# Altium schematic sheet Others.SchDoc: Others
size A4; ApprovedBy: Eli; CheckedBy: Eli; DrawnBy: Eli; Engineer: Eli; Organization: 富源盛电子科技有限公司; Address1: 深圳市龙华新区; Address2: 观澜街道科利邦工业园; Address3: B栋（宿舍楼）15楼; Address4: T: 159 8944 7740; DocumentNumber: 3; Revision: 1.0; SheetNumber: 3; SheetTotal: 8; Status: Final
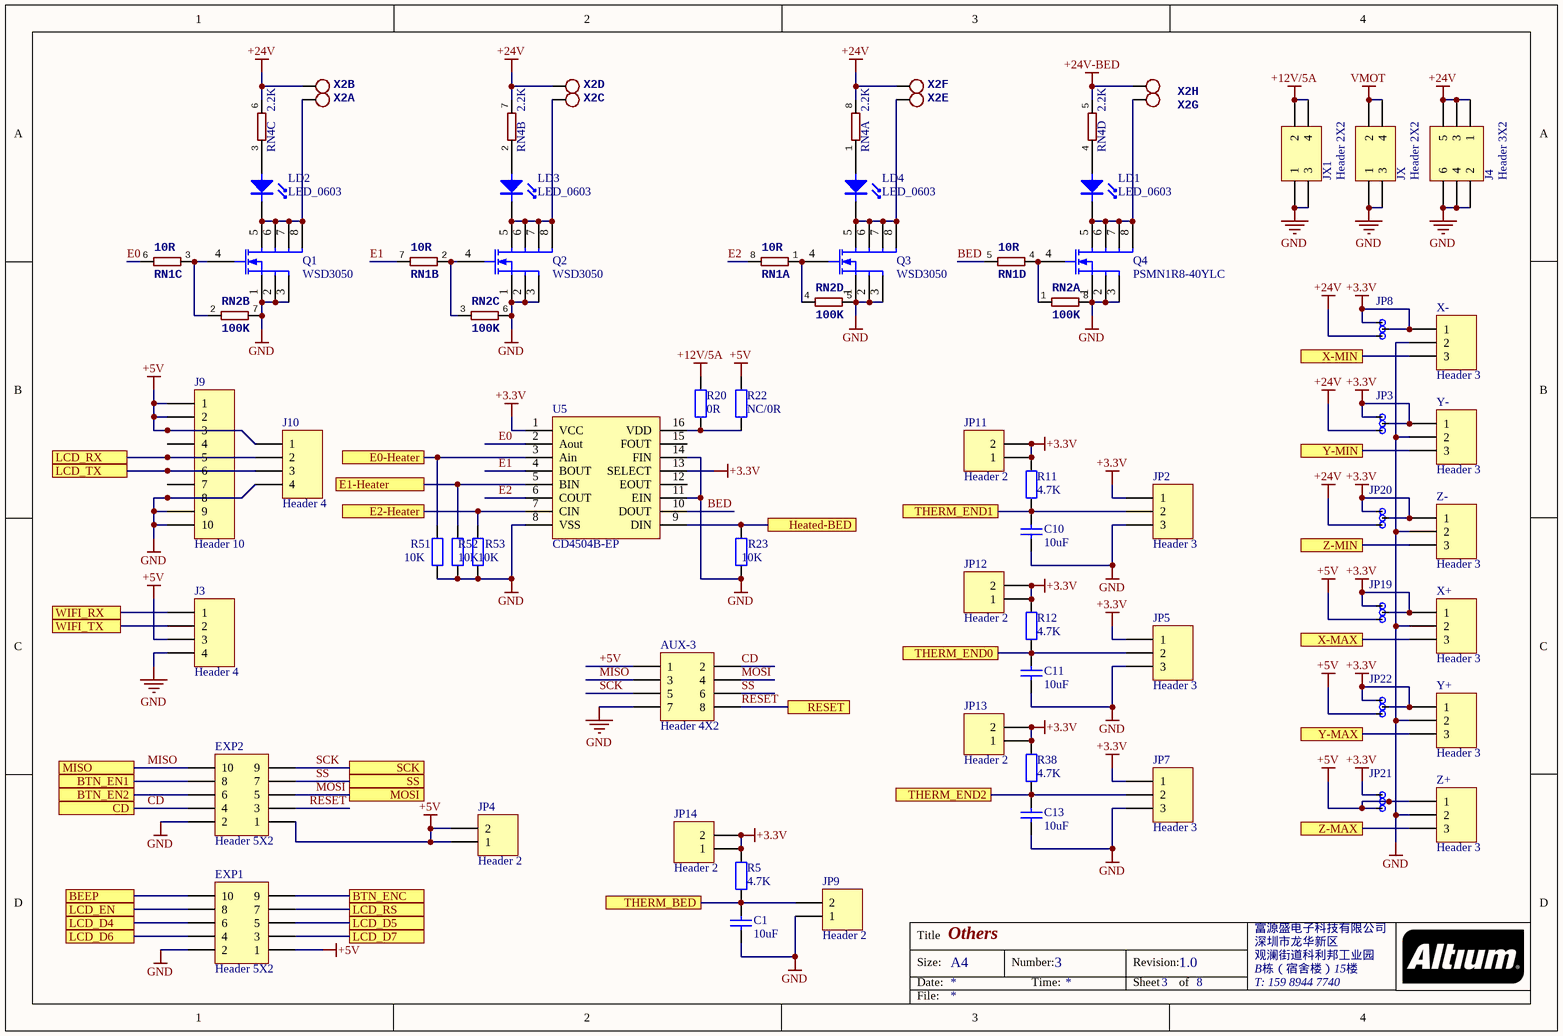
[diagram p0: Others.SchDoc]

## Parts
AUX-3  Header 4X2  [Header 2X4]
C1  10uF  [CAP0805]
C10  10uF  [CAP0805]
C11  10uF  [CAP0805]
C13  10uF  [CAP0805]
EXP1  Header 5X2  [CON-ML_ML10]
EXP2  Header 5X2  [CON-ML_ML10]
J3  Header 4  [1x4 MTE Straight Header 2.54mm]
J4  Header 3X2  [header 2X3]
J9  Header 10  [1.0mm_掀盖FPC]
J10  Header 4  [Header 1X4]
JP2  Header 3  [1X3 MTE STRAIGHT HEADER 2.54MM]
JP3  Jumper-3P  [PAD-JUMPER-3-2OF3_NC_BY_PASTE_YES_SILK_FULL_BOX]  (value not drawn)
JP4  Header 2  [Jumper2]
JP5  Header 3  [1X3 MTE STRAIGHT HEADER 2.54MM]
JP7  Header 3  [1X3 MTE STRAIGHT HEADER 2.54MM]
JP8  Jumper-3P  [PAD-JUMPER-3-2OF3_NC_BY_PASTE_YES_SILK_FULL_BOX]  (value not drawn)
JP9  Header 2  [1X2 MTE STRAIGHT HEADER 2.54MM]
JP11  Header 2  [Jumper2]
JP12  Header 2  [Jumper2]
JP13  Header 2  [Jumper2]
JP14  Header 2  [Jumper2]
JP19  Jumper-3P  [PAD-JUMPER-3-2OF3_NC_BY_PASTE_YES_SILK_FULL_BOX]  (value not drawn)
JP20  Jumper-3P  [PAD-JUMPER-3-2OF3_NC_BY_PASTE_YES_SILK_FULL_BOX]  (value not drawn)
JP21  Jumper-3P  [PAD-JUMPER-3-2OF3_NC_BY_PASTE_YES_SILK_FULL_BOX]  (value not drawn)
JP22  Jumper-3P  [PAD-JUMPER-3-2OF3_NC_BY_PASTE_YES_SILK_FULL_BOX]  (value not drawn)
JX  Header 2X2  [Header 2X2]
JX1  Header 2X2  [Header 2X2]
LD1  LED_0603  [LED0603]
LD2  LED_0603  [LED0603]
LD3  LED_0603  [LED0603]
LD4  LED_0603  [LED0603]
Q1  WSD3050  [DFN3X3-8L]
Q2  WSD3050  [DFN3X3-8L]
Q3  WSD3050  [DFN3X3-8L]
Q4  PSMN1R8-40YLC  [NXP_LFPAK56]
R5  4.7K  [RES0603]
R11  4.7K  [RES0603]
R12  4.7K  [RES0603]
R20  0R  [RES0603]
R22  NC/0R  [RES0603]
R23  10K  [RES0603]
R38  4.7K  [RES0603]
R51  10K  [RES0603]
R52  10K  [RES0603]
R53  10K  [RES0603]
RN1  10R  [RESISTOR-DIL_CAY16]  (parts A,B,C,D of 4)
RN2  100K  [RESISTOR-DIL_CAY16]  (parts A,B,C,D of 4)
RN4  2.2K  [RESISTOR-DIL_CAY16]  (parts A,B,C,D of 4)
U5  CD4504B-EP  [SSOP16]
X2  5.08-12P  [CON-PHOENIX-508_MKDSN1,5/12-5,08]  (value not drawn)  (parts A,B,C,D,E,F,G,H of 12)
X+  Header 3  [1x3 MTE Straight Header 2.54mm]
X-  Header 3  [1x3 MTE Straight Header 2.54mm]
Y+  Header 3  [1x3 MTE Straight Header 2.54mm]
Y-  Header 3  [1x3 MTE Straight Header 2.54mm]
Z+  Header 3  [1x3 MTE Straight Header 2.54mm]
Z-  Header 3  [1x3 MTE Straight Header 2.54mm]

## Ports
BEEP, BTN_EN1, BTN_EN2, BTN_ENC, CD, E0-Heater, E1-Heater, E2-Heater, Heated-BED, LCD_D4, LCD_D5, LCD_D6, LCD_D7, LCD_EN, LCD_RS, LCD_RX, LCD_TX, MISO, MOSI, RESET, SCK, SS, THERM_BED, THERM_END0, THERM_END1, THERM_END2, WIFI_RX, WIFI_TX, X-MAX, X-MIN, Y-MAX, Y-MIN, Z-MAX, Z-MIN

## Nets
+3.3V: JP2.1 JP3.1 JP3.2 JP5.1 JP7.1 JP8.1 JP8.2 JP11.1 JP11.2 JP12.1 JP12.2 JP13.1 JP13.2 JP14.1 JP14.2 JP19.1 JP19.2 JP20.1 JP20.2 JP21.1 JP22.1 JP22.2 R5.2 R11.2 R12.2 R38.2 U5.1(VCC) U5.13(SELECT) X+.1 X-.1 Y+.1 Y-.1 Z-.1
+5V: AUX-3.1 EXP1.1 EXP2.1 J3.3 J9.1 J9.2 J9.3 J10.1 JP4.1 JP4.2 JP19.3 JP21.2 JP21.3 JP22.3 R22.1 Z+.1
+12V/5A: JX1.2 JX1.4 R20.1
+24V: J4.1 J4.3 J4.5 JP3.3 JP8.3 JP20.3 RN4.6 RN4.7 RN4.8 X2.2(KL) X2.4(KL) X2.6(KL)
+24V-BED: RN4.5 X2.8(KL)
GND: AUX-3.7 C1.1 C10.1 C11.1 C13.1 EXP1.2 EXP2.2 J3.4 J4.2 J4.4 J4.6 J9.8 J9.9 J9.10 J10.4 JP2.3 JP5.3 JP7.3 JP9.1 JX.1 JX.3 JX1.1 JX1.3 Q1.1(S) Q1.2(S) Q1.3(S) Q2.1(S) Q2.2(S) Q2.3(S) Q3.1(S) Q3.2(S) Q3.3(S) Q4.1(S) Q4.2(S) Q4.3(S) R23.2 R51.2 R52.2 R53.2 RN2.5 RN2.6 RN2.7 RN2.8 U5.8(VSS) U5.11(EIN) U5.14(FIN) X+.2 X-.2 Y+.2 Y-.2 Z+.2 Z-.2
VMOT: JX.2 JX.4
BED: RN1.5 U5.10(DOUT)
BEEP: EXP1.10 ; port BEEP
BTN_EN1: EXP2.8 ; port BTN_EN1
BTN_EN2: EXP2.6 ; port BTN_EN2
BTN_ENC: EXP1.9 ; port BTN_ENC
CD: AUX-3.2 EXP2.4 ; port CD
E0: RN1.6 U5.2(Aout)
E0-Heater: R51.1 U5.3(Ain) ; port E0-Heater
E1: RN1.7 U5.4(BOUT)
E1-Heater: R52.1 U5.5(BIN) ; port E1-Heater
E2: RN1.8 U5.6(COUT)
E2-Heater: R53.1 U5.7(CIN) ; port E2-Heater
Heated-BED: R23.1 U5.9(DIN) ; port Heated-BED
LCD_D4: EXP1.6 ; port LCD_D4
LCD_D5: EXP1.5 ; port LCD_D5
LCD_D6: EXP1.4 ; port LCD_D6
LCD_D7: EXP1.3 ; port LCD_D7
LCD_EN: EXP1.8 ; port LCD_EN
LCD_RS: EXP1.7 ; port LCD_RS
LCD_RX: J9.5 J10.2 ; port LCD_RX
LCD_TX: J9.6 J10.3 ; port LCD_TX
MISO: AUX-3.3 EXP2.10 ; port MISO
MOSI: AUX-3.4 EXP2.5 ; port MOSI
RESET: AUX-3.8 EXP2.3 ; port RESET
SCK: AUX-3.5 EXP2.9 ; port SCK
SS: AUX-3.6 EXP2.7 ; port SS
THERM_BED: C1.2 JP9.2 R5.1 ; port THERM_BED
THERM_END0: C11.2 JP5.2 R12.1 ; port THERM_END0
THERM_END1: C10.2 JP2.2 R11.1 ; port THERM_END1
THERM_END2: C13.2 JP7.2 R38.1 ; port THERM_END2
WIFI_RX: J3.1 ; port WIFI_RX
WIFI_TX: J3.2 ; port WIFI_TX
X-MAX: X+.3 ; port X-MAX
X-MIN: X-.3 ; port X-MIN
Y-MAX: Y+.3 ; port Y-MAX
Y-MIN: Y-.3 ; port Y-MIN
Z-MAX: Z+.3 ; port Z-MAX
Z-MIN: Z-.3 ; port Z-MIN
NetLD1_1: LD1.1(A) Q4.5(D) Q4.6(D) Q4.7(D) Q4.8(D) X2.7(KL)
NetLD1_2: LD1.2(K) RN4.4
NetLD2_1: LD2.1(A) Q1.5(D) Q1.6(D) Q1.7(D) Q1.8(D) X2.1(KL)
NetLD2_2: LD2.2(K) RN4.3
NetLD3_1: LD3.1(A) Q2.5(D) Q2.6(D) Q2.7(D) Q2.8(D) X2.3(KL)
NetLD3_2: LD3.2(K) RN4.2
NetLD4_1: LD4.1(A) Q3.5(D) Q3.6(D) Q3.7(D) Q3.8(D) X2.5(KL)
NetLD4_2: LD4.2(K) RN4.1
NetQ1_4: Q1.4(G) RN1.3 RN2.2
NetQ2_4: Q2.4(G) RN1.2 RN2.3
NetQ3_4: Q3.4(G) RN1.1 RN2.4
NetQ4_4: Q4.4(G) RN1.4 RN2.1
NetR20_2: R20.2 R22.2 U5.16(VDD)

Not connected (* = marked no-connect by the designer): J9 4 7; U5 12(EOUT) 15(FOUT)

## Notes on the sheet
- Title
- Size:
- Date:
- A4
- Number:
- Time:
- Revision:
- Sheet
- of
- File:

## Library data of the parts
AUX-3 = Header 4X2: Header, 4-Pin, Dual row; LatestRevisionDate: 17-Jul-2002; LatestRevisionNote: Re-released for DXP Platform.; Publisher: Altium Limited
C1 C10 C11 C13 = Library_CAP-0008: RO C0G 22pF 2% 50V  0603; Faber ItemCode: 35321100; ID: Library_CAP-0008; Value: 10uF
EXP1 EXP2 = Header 5X2: Header, 5-Pin, Dual row; LatestRevisionDate: 17-Jul-2002; LatestRevisionNote: Re-released for DXP Platform.; Publisher: Altium Limited
J3 J10 = Header 4: Header, 4-Pin; LatestRevisionDate: 17-Jul-2002; LatestRevisionNote: Re-released for DXP Platform.; Publisher: Altium Limited
J4 = Header 3X2: Header, 3-Pin, Dual row; LatestRevisionDate: 17-Jul-2002; LatestRevisionNote: Re-released for DXP Platform.; Publisher: Altium Limited
J9 = Header 10: Header, 10-Pin; LatestRevisionDate: 17-Jul-2002; LatestRevisionNote: Re-released for DXP Platform.; Publisher: Altium Limited
JP2 JP5 JP7 X+ X- Y+ Y- Z+ Z- = Header 3: Header, 3-Pin; LatestRevisionDate: 17-Jul-2002; LatestRevisionNote: Re-released for DXP Platform.; Publisher: Altium Limited
JP4 JP9 JP11-JP14 = Header 2: Header, 2-Pin; LatestRevisionDate: 17-Jul-2002; LatestRevisionNote: Re-released for DXP Platform.; Publisher: Altium Limited
JX JX1 = Header 2X2: Header, 2-Pin, Dual row; LatestRevisionDate: 17-Jul-2002; LatestRevisionNote: Re-released for DXP Platform.; Publisher: Altium Limited
Q1-Q4 = MOSFET-N-SO8: IRF8736PBF - MOSFET, N SO-8; Mfg: INTERNATIONAL RECTIFIER; ID: LIBRARY_FET-0002; Info: HEXFET Power MOSFET; Faber ItemCode: 36926000; Mfg code: IRF8736PBF; Value: IRF8736PBF
R5 R11 R12 R38 = Library_RES-0001: RO RES 10k0 1% 0,063W  0603; Faber ItemCode: 36084500; ID: Library_RES-0001; Info: Resistor; Value: 4.7K
R20 R22 R23 R51-R53 = Library_RES-0001: RO RES 10k0 1% 0,063W  0603; Faber ItemCode: 36084500; Value: 4.7K; ID: Library_RES-0001; Info: Resistor
RN1 RN2 RN4 = RESISTOR-DIL_4R-NCAT16: OC_FARNELL: unknown; OC_NEWARK: unknown
X2 = CON-PHOENIX-508_MKDSN1,5/12-5,08: MPN: SMKDSN1,5/10-5,08; OC_FARNELL: 1792913; OC_NEWARK: 70R0297